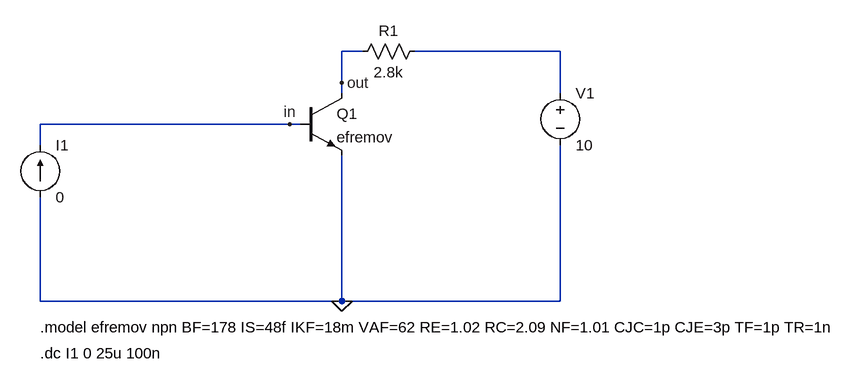
[diagram p0: schematic 1.asc]
1.asc, the LTspice schematic file:
Version 4
SHEET 1 1164 680
WIRE 240 48 208 48
WIRE 544 48 320 48
WIRE 208 96 208 48
WIRE 208 112 208 96
WIRE 544 112 544 48
WIRE 128 160 -256 160
WIRE 144 160 128 160
WIRE -256 192 -256 160
WIRE -256 432 -256 272
WIRE 208 432 208 208
WIRE 208 432 -256 432
WIRE 544 432 544 192
WIRE 544 432 208 432
FLAG 208 432 0
FLAG 208 96 out
FLAG 128 160 in
SYMBOL npn 144 112 R0
SYMATTR InstName Q1
SYMATTR Value efremov
SYMBOL voltage 544 96 R0
WINDOW 123 0 0 Left 2
WINDOW 39 0 0 Left 2
SYMATTR InstName V1
SYMATTR Value 10
SYMBOL current -256 272 M180
WINDOW 0 24 80 Left 2
WINDOW 3 24 0 Left 2
WINDOW 123 0 0 Left 2
WINDOW 39 0 0 Left 2
SYMATTR InstName I1
SYMATTR Value 0
SYMBOL res 336 32 R90
WINDOW 0 0 56 VBottom 2
WINDOW 3 32 56 VTop 2
SYMATTR InstName R1
SYMATTR Value 2.8k
TEXT -256 472 Left 2 !.model efremov npn BF=178 IS=48f IKF=18m VAF=62 RE=1.02 RC=2.09 NF=1.01 CJC=1p CJE=3p TF=1p TR=1n
TEXT -256 512 Left 2 !.dc I1 0 25u 100n

The netlist it stands for:
* 1.asc
Q1 out in 0 0 efremov
V1 N001 0 10
I1 0 in 0
R1 N001 out 2.8k
.model NPN NPN
.model PNP PNP
.lib standard.bjt
.model efremov npn BF=178 IS=48f IKF=18m VAF=62 RE=1.02 RC=2.09 NF=1.01 CJC=1p CJE=3p TF=1p TR=1n
.dc I1 0 25u 100n
.backanno
.end

* Results of the author's LTspice run, read from the files saved beside the schematic
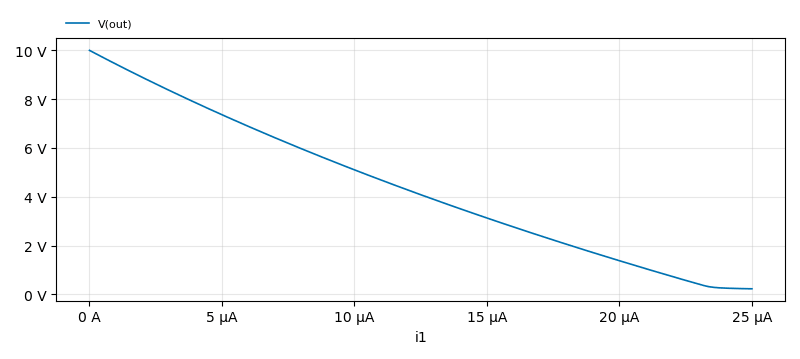
[diagram p1: DC transfer characteristic of 1.asc, plotted from the saved traces]
* DC transfer characteristic, 1 run:
*   V(out): 10 V at i1=0 A, 225.1 mV at i1=25 µA, min 225.1 mV, max 10 V